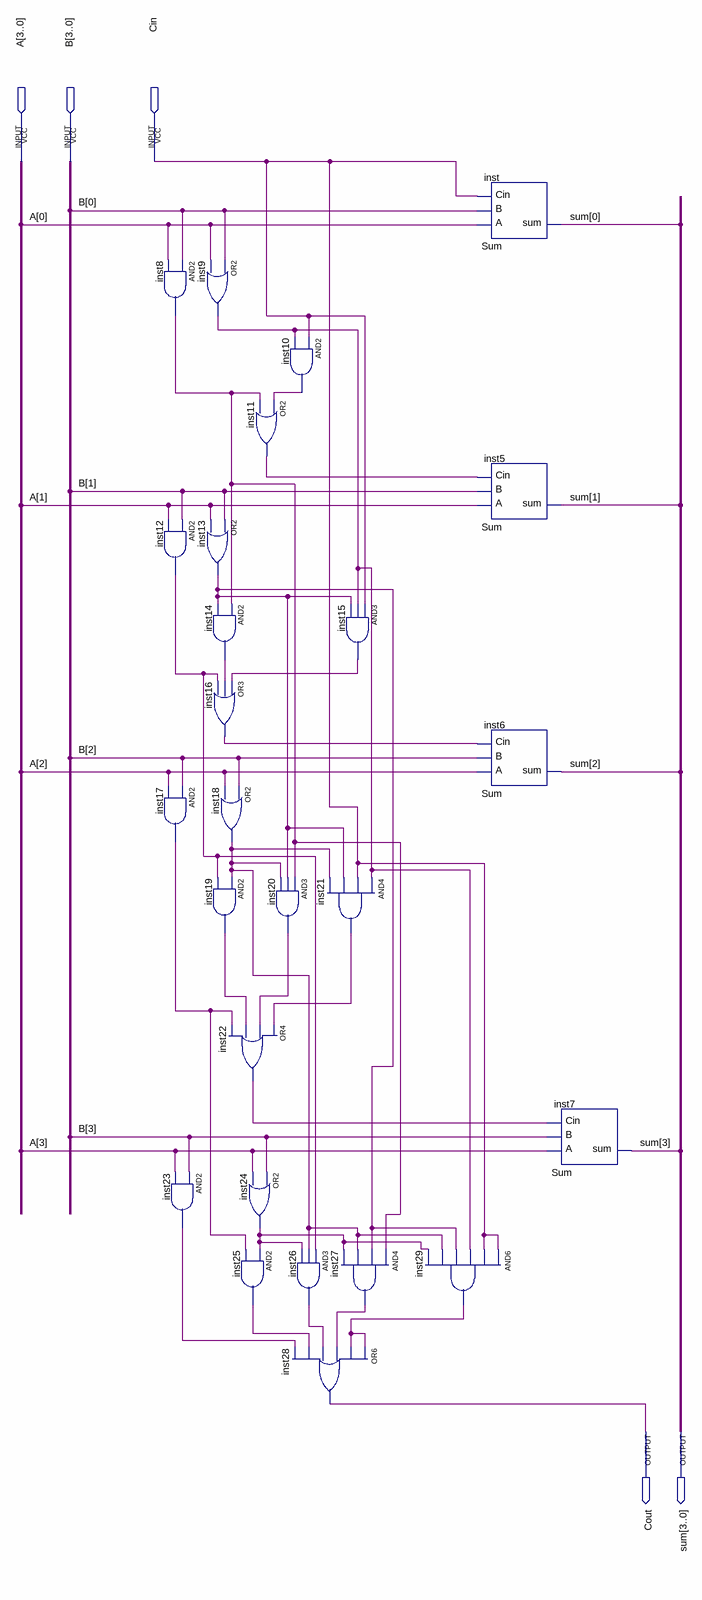
[diagram p0: schematic sheet]
// Quartus schematic fourbitadder.bdf as structural Verilog: 26 symbols, 5 pins
module fourbitadder (
  input  [3:0] A,
  input  [3:0] B,
  input  Cin,
  output Cout,
  output [3:0] sum
);

  wire inst8_out, inst9_out, inst10_out, inst11_out, inst12_out, inst13_out, inst14_out, inst15_out,
       inst16_out, inst17_out, inst18_out, inst19_out, inst20_out, inst21_out, inst22_out, inst23_out,
       inst24_out, inst25_out, inst26_out, inst27_out, inst29_out;

  and inst8 (inst8_out, B[0], A[0]);
  and inst12 (inst12_out, B[1], A[1]);
  and inst17 (inst17_out, B[2], A[2]);
  and inst23 (inst23_out, B[3], A[3]);
  or inst9 (inst9_out, B[0], A[0]);
  or inst13 (inst13_out, B[1], A[1]);
  and inst14 (inst14_out, inst8_out, inst13_out);
  or inst16 (inst16_out, inst15_out, inst14_out, inst12_out);
  or inst18 (inst18_out, B[2], A[2]);
  and inst19 (inst19_out, inst18_out, inst12_out);
  or inst22 (inst22_out, inst21_out, inst20_out, inst19_out, inst17_out);
  and inst25 (inst25_out, inst24_out, inst17_out);
  and inst10 (inst10_out, Cin, inst9_out);
  or inst11 (inst11_out, inst10_out, inst8_out);
  and inst20 (inst20_out, inst8_out, inst13_out, inst18_out);
  or inst24 (inst24_out, B[3], A[3]);
  and inst26 (inst26_out, inst12_out, inst18_out, inst24_out);
  or inst28 (Cout, inst29_out, inst29_out, inst27_out, inst26_out, inst25_out, inst23_out);
  and inst15 (inst15_out, Cin, inst9_out, inst13_out);
  and inst21 (inst21_out, inst9_out, Cin, inst13_out, inst18_out);
  and inst27 (inst27_out, inst8_out, inst13_out, inst18_out, inst24_out);
  and inst29 (inst29_out, Cin, Cin, inst9_out, inst13_out, inst18_out, inst24_out);
  Sum inst (.A(A[0]), .B(B[0]), .Cin(Cin), .sum(sum[0]));
  Sum inst5 (.A(A[1]), .B(B[1]), .Cin(inst11_out), .sum(sum[1]));
  Sum inst6 (.A(A[2]), .B(B[2]), .Cin(inst16_out), .sum(sum[2]));
  Sum inst7 (.A(A[3]), .B(B[3]), .Cin(inst22_out), .sum(sum[3]));
endmodule
